# EasyEDA schematic SCH_SD-pcb-t14_2026-02-01.json
TITLE: Sheet_1; REV: 1.0; Date: 2026-01-29; Sheet: 1/1; Drawn By: polypheidesbiz; Company: Your Company
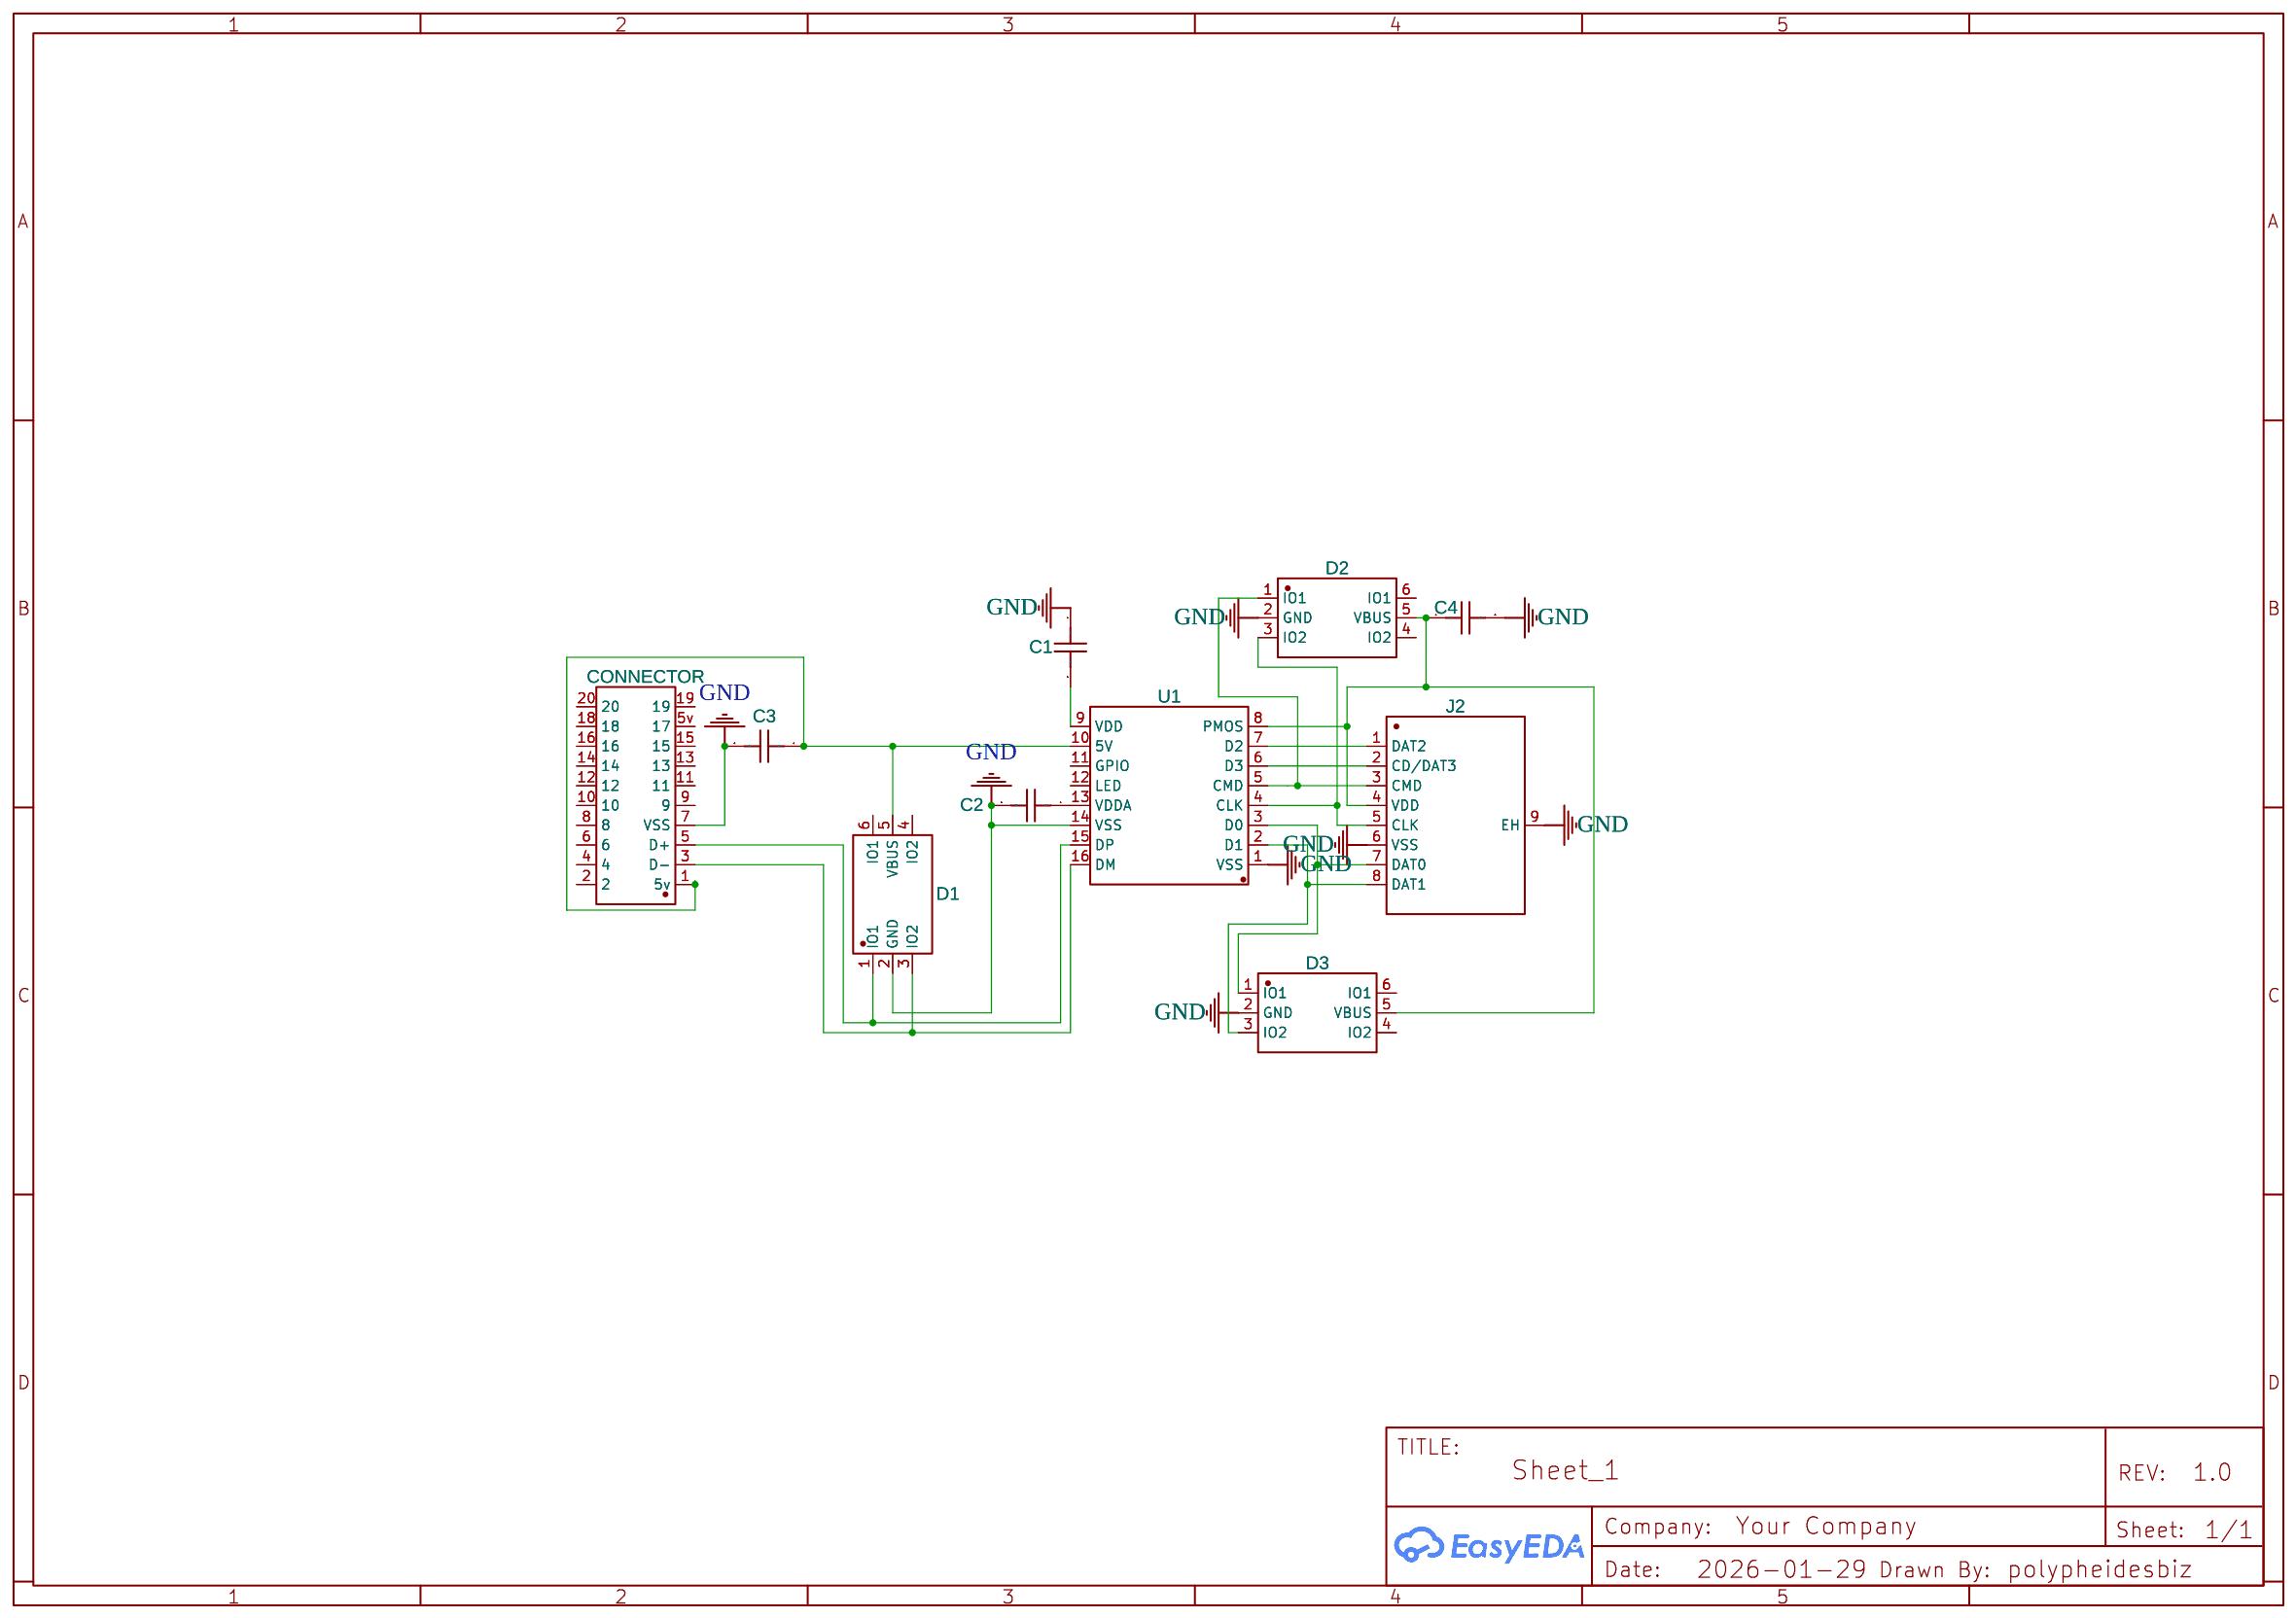
[diagram p0: schematic sheet]

## Parts
C1  100nF  [C0603]
C2  100nF  [C0603]
C3  100nF  [C0603]
C4  100nF  [C0603]
CONNECTOR  DF40C-20DS-0.4V(51)  [CONN-SMD_20P-P0.40_DF40C-20DS-0.4V]
D1  USBLC6-2SC6_C2827654  [SOT-23-6_L2.9-W1.6-P0.95-LS2.8-BL]
D2  USBLC6-2SC6_C2827654  [SOT-23-6_L2.9-W1.6-P0.95-LS2.8-BL]
D3  USBLC6-2SC6_C2827654  [SOT-23-6_L2.9-W1.6-P0.95-LS2.8-BL]
J2  TF-009  [TF-SMD_TF-009]
U1  GL823K-HCY04  [SSOP-16_L4.9-W3.9-P0.64-LS6.0-BL]

## Library data of the parts
C1-C4 = AC0603KRX7R8BB104: Contributor: LCSC; Supplier: LCSC; Supplier Part: C327096; Manufacturer: YAGEO(国巨); JLCPCB Part Class: Extended Part
CONNECTOR = DF40C-20DS-0.4V(51): Contributor: LCSC; Supplier: LCSC; Supplier Part: C424638; Manufacturer: HRS(广濑); JLCPCB Part Class: Extended Part
D1-D3 = USBLC6-2SC6_C2827654: Contributor: LCSC; Supplier: LCSC; Supplier Part: C2827654; Manufacturer: TECH PUBLIC(台舟); Manufacturer Part: USBLC6-2SC6; JLCPCB Part Class: Extended Part
J2 = TF-009: Contributor: LCSC; Supplier: LCSC; Supplier Part: C428466; Manufacturer: SOFNG(硕方); JLCPCB Part Class: Extended Part
U1 = GL823K-HCY04: Contributor: LCSC; Supplier: LCSC; Supplier Part: C284879; Manufacturer: GENESYS(创惟); JLCPCB Part Class: Extended Part

## Nets
GND: C1.1 C2.2 C3.2 C4.2 CONNECTOR.7(VSS) D1.2(GND) D2.2(GND) D3.2(GND) J2.6(VSS) J2.9(EH) U1.1(VSS) U1.14(VSS)
Net-(C1-2): C1.2 U1.9(VDD)
Net-(C2-1): C2.1 U1.13(VDDA)
Net-(C3-1): C3.1 CONNECTOR.1(5v) D1.5(VBUS) U1.10(5V)
Net-(C4-1): C4.1 D2.5(VBUS) D3.5(VBUS) J2.4(VDD) U1.8(PMOS)
Net-(CONNECTOR-3): CONNECTOR.3(D-) D1.3(IO2) U1.16(DM)
Net-(CONNECTOR-5): CONNECTOR.5(D+) D1.1(IO1) U1.15(DP)
Net-(D2-1): D2.1(IO1) J2.3(CMD) U1.5(CMD)
Net-(D2-3): D2.3(IO2) J2.5(CLK) U1.4(CLK)
Net-(D3-1): D3.1(IO1) J2.7(DAT0) U1.3(D0)
Net-(D3-3): D3.3(IO2) J2.8(DAT1) U1.2(D1)
Net-(J2-1): J2.1(DAT2) U1.7(D2)
Net-(J2-2): J2.2(CD/DAT3) U1.6(D3)

Not connected (* = marked no-connect by the designer): CONNECTOR 2 4 5v(17) 6 8 9 10 11 12 13 14 15 16 18 19 20; D1 4(IO2) 6(IO1); D2 4(IO2) 6(IO1); D3 4(IO2) 6(IO1); U1 11(GPIO) 12(LED)
